# EAGLE design nWatch_BGA (EAGLE 6.4)
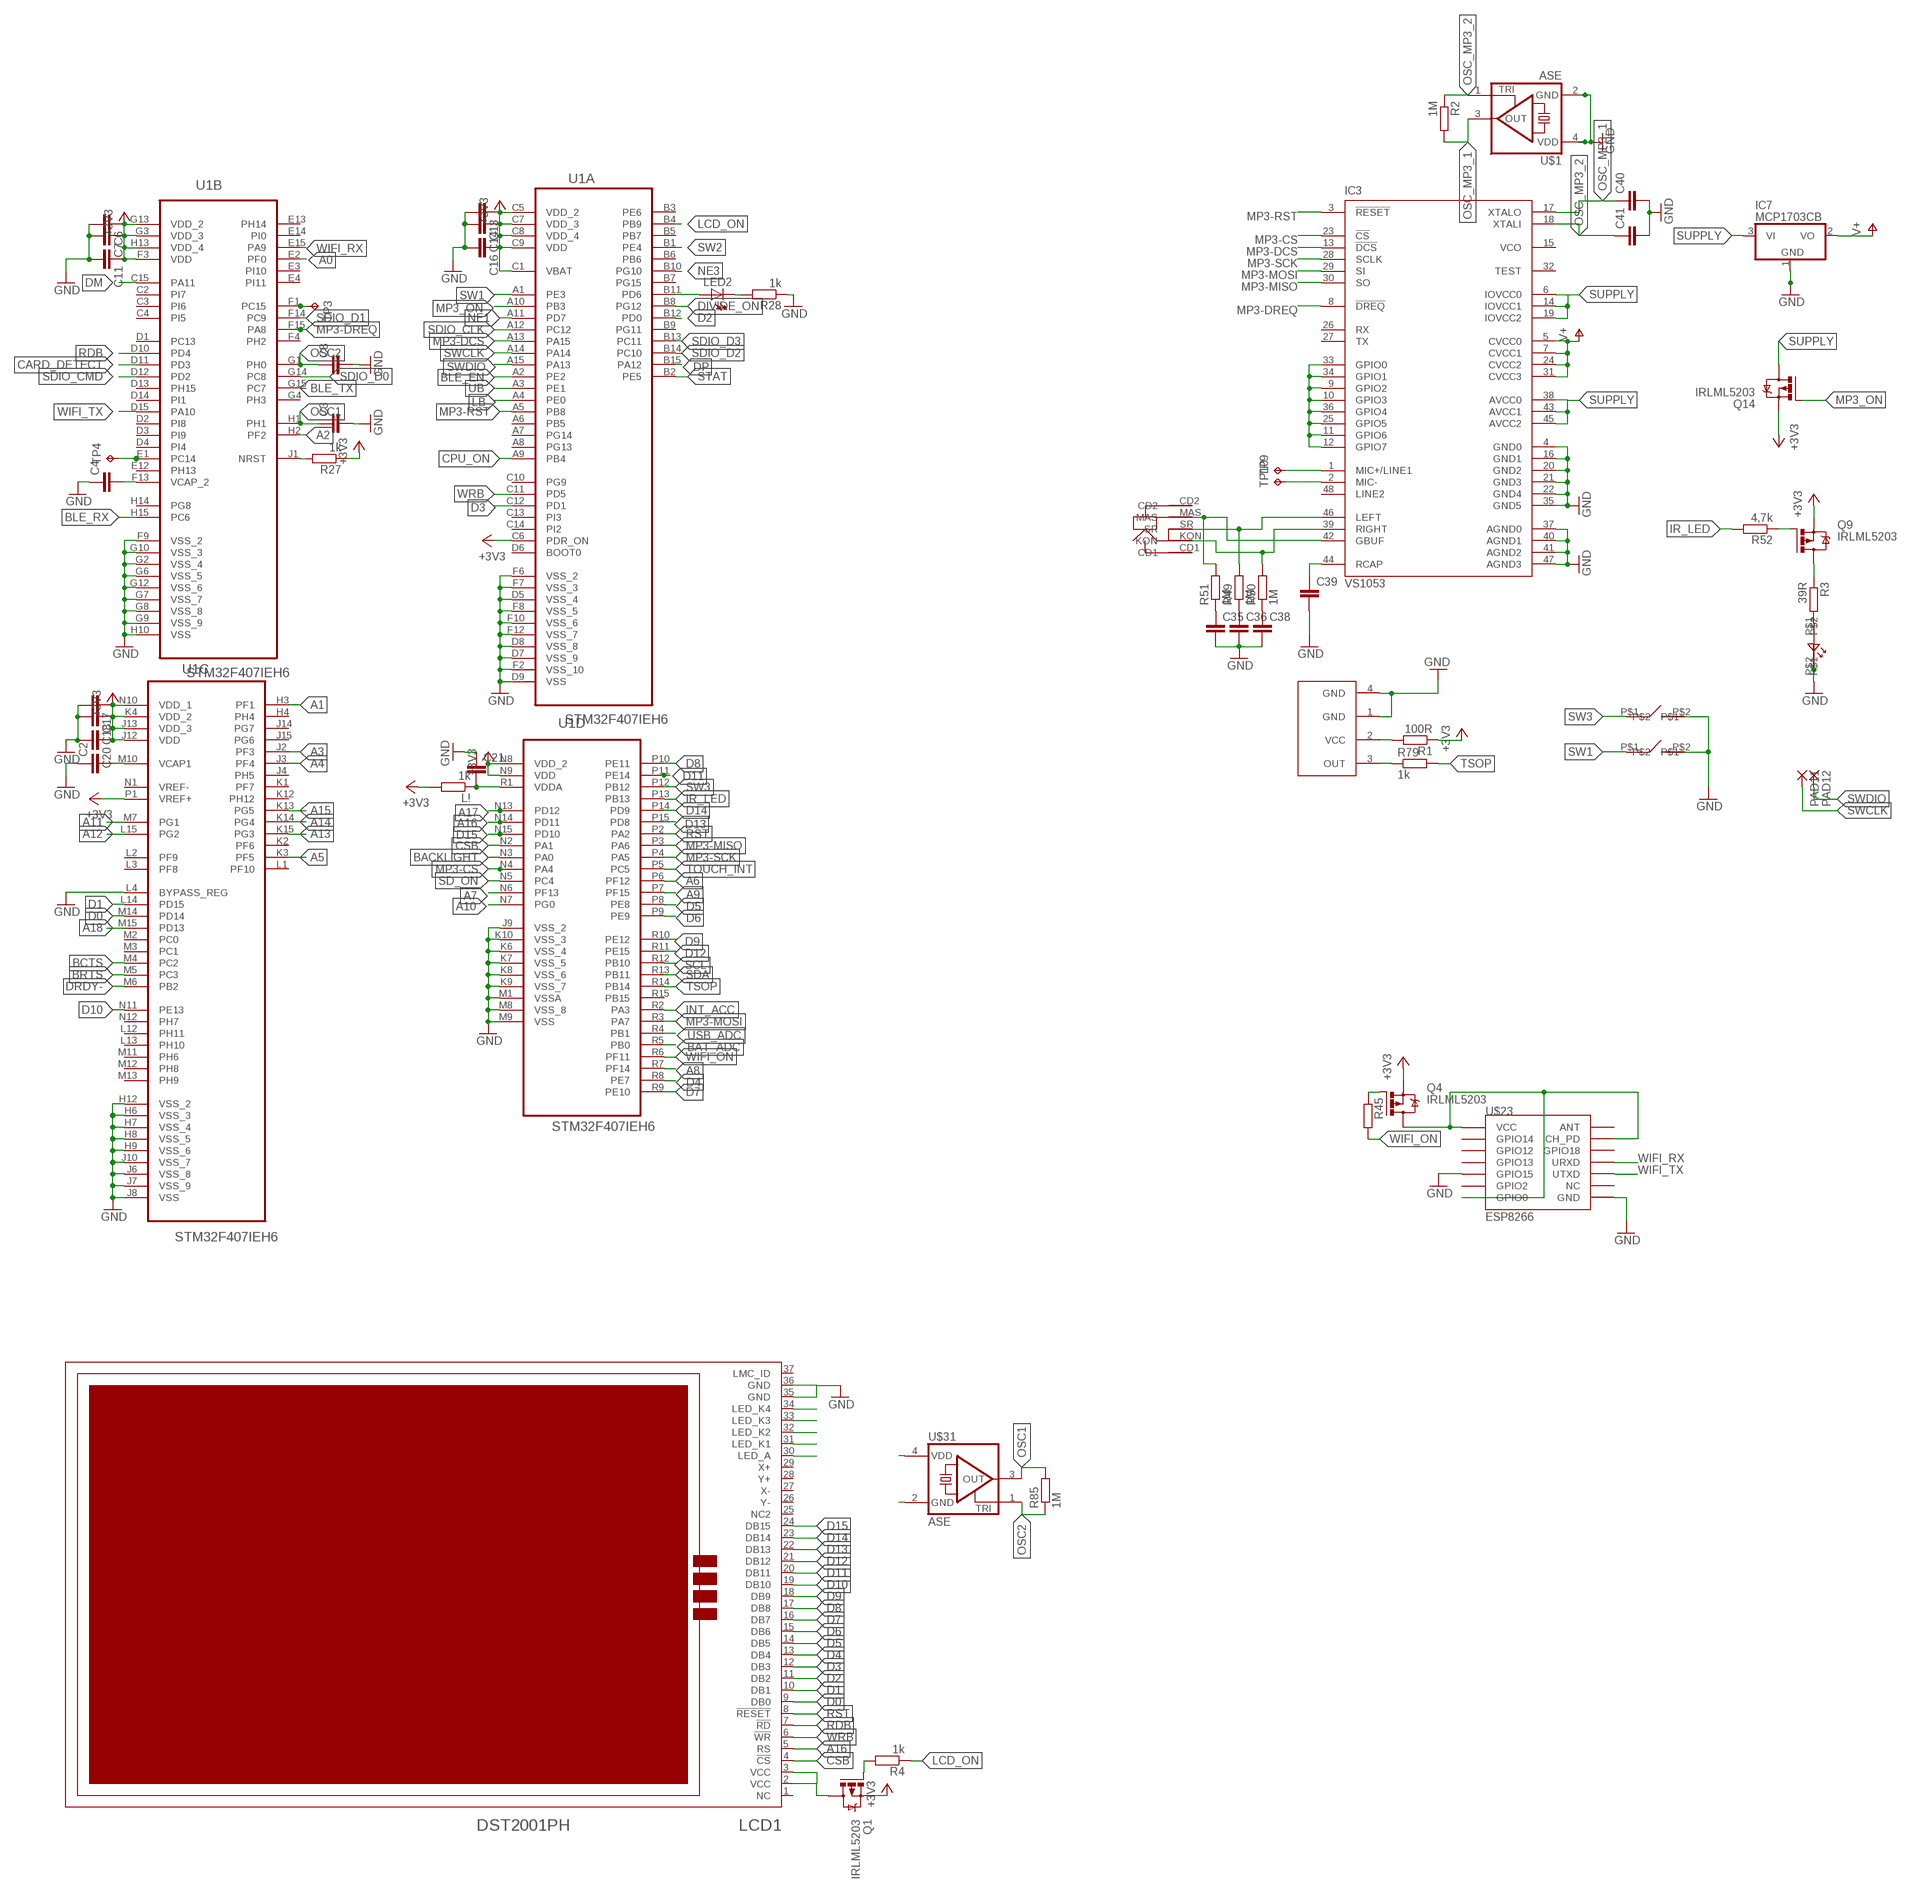
[diagram p0: schematic, sheet 1, part 1 of 2]
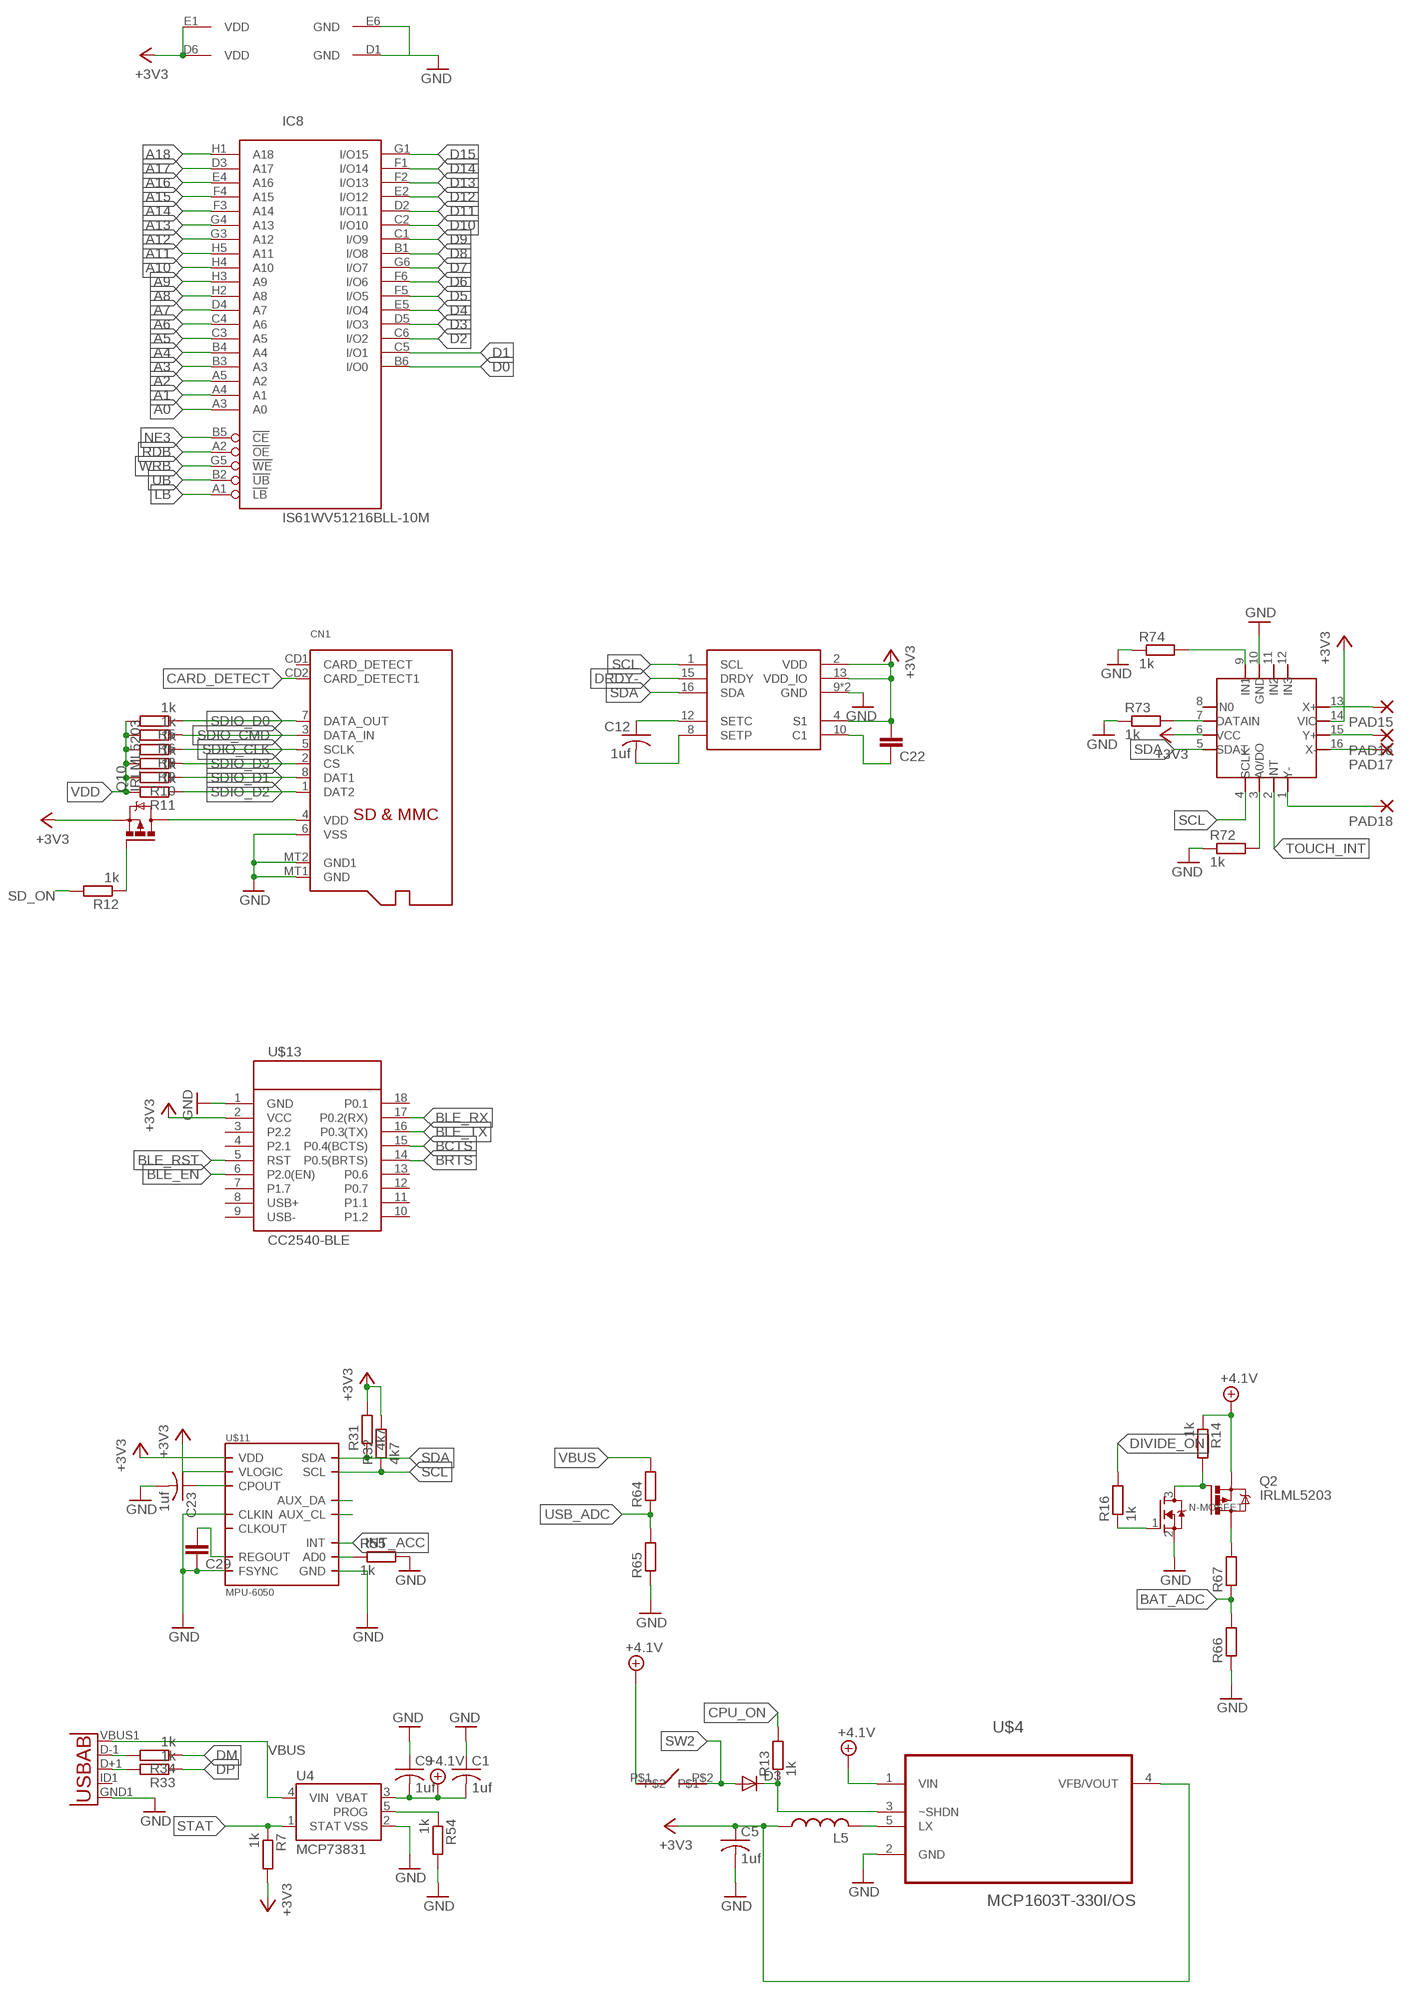
[diagram p1: schematic, sheet 1, part 2 of 2]

## Parts
C1  1uf  C-USC0805K  [C0805K]
C2  C-EUC0402  [C0402]
C3  C-EUC0402  [C0402]
C4  C-EUC0402  [C0402]
C5  1uf  C-USC0805K  [C0805K]
C6  C-EUC0402  [C0402]
C7  C-EUC0402  [C0402]
C8  C-EUC0402  [C0402]
C9  1uf  C-USC0805K  [C0805K]
C11  C-EUC0402  [C0402]
C12  1uf  C-USC0805K  [C0805K]
C13  C-EUC0402  [C0402]
C14  C-EUC0402  [C0402]
C16  C-EUC0402  [C0402]
C17  C-EUC0402  [C0402]
C18  C-EUC0402  [C0402]
C20  C-EUC0402  [C0402]
C21  C-EUC0402  [C0402]
C22  C-EUC0603K  [C0603K]
C23  1uf  C-USC0805K  [C0805K]
C29  C-EUC0603K  [C0603K]
C35  C-EUC0402  [C0402]
C36  C-EUC0402  [C0402]
C38  C-EUC0402  [C0402]
C39  C-EUC0402  [C0402]
C40  C-EUC0402  [C0402]
C41  C-EUC0402  [C0402]
CN1  MICROSD  [MICROSD]
D3  MBR0520LT  [SOD123]
IC3  VS1053  [LQFP-48]
IC7  MCP1703CB  [SOT23]
IC8  IS61WV51216BLL-10M  [TFBGA48_9X11]
L5  L-USL2825P  [L2825P]
L!  1k  R-EU_R0402  [R0402]
LCD1  DST2001PH  [DST2001PH]
LED2  LEDCHIPLED_0603  [CHIPLED_0603]
N-MOSFET  MOSFET-NREFLOW  [SOT23]
PAD11  SMD2  [SMD1,27-2,54]
PAD12  SMD2  [SMD1,27-2,54]
PAD15  SMD2  [SMD1,27-2,54]
PAD16  SMD2  [SMD1,27-2,54]
PAD17  SMD2  [SMD1,27-2,54]
PAD18  SMD2  [SMD1,27-2,54]
Q1  IRLML5203  [MICRO3]
Q2  IRLML5203  [MICRO3]
Q4  IRLML5203  [MICRO3]
Q9  IRLML5203  [MICRO3]
Q10  IRLML5203  [MICRO3]
Q14  IRLML5203  [MICRO3]
R1  100R  R-EU_R0402  [R0402]
R2  1M  R-EU_R0402  [R0402]
R3  39R  R-EU_R0402  [R0402]
R4  1k  R-EU_R0402  [R0402]
R5  1k  R-EU_R0402  [R0402]
R6  1k  R-EU_R0402  [R0402]
R7  1k  R-EU_R0402  [R0402]
R8  1k  R-EU_R0402  [R0402]
R9  1k  R-EU_R0402  [R0402]
R10  1k  R-EU_R0402  [R0402]
R11  1k  R-EU_R0402  [R0402]
R12  1k  R-EU_R0402  [R0402]
R13  1k  R-EU_R0402  [R0402]
R14  1k  R-EU_R0402  [R0402]
R16  1k  R-EU_R0402  [R0402]
R27  1k  R-EU_R0402  [R0402]
R28  1k  R-EU_R0402  [R0402]
R31  4k7  R-EU_R0402  [R0402]
R32  4k7  R-EU_R0402  [R0402]
R33  1k  R-EU_R0402  [R0402]
R34  1k  R-EU_R0402  [R0402]
R45  R-EU_R0603  [R0603]
R49  1M  R-EU_R0402  [R0402]
R50  1M  R-EU_R0402  [R0402]
R51  1M  R-EU_R0402  [R0402]
R52  4,7k  R-EU_R0402  [R0402]
R54  1k  R-EU_R0402  [R0402]
R55  1k  R-EU_R0402  [R0402]
R64  R-EU_R0402  [R0402]
R65  R-EU_R0402  [R0402]
R66  R-EU_R0402  [R0402]
R67  R-EU_R0402  [R0402]
R72  1k  R-EU_R0402  [R0402]
R73  1k  R-EU_R0402  [R0402]
R74  1k  R-EU_R0402  [R0402]
R79  1k  R-EU_R0402  [R0402]
R85  1M  R-EU_R0402  [R0402]
TP3  TPTP08SQ  [TP08SQ]
TP4  TPTP08SQ  [TP08SQ]
TP9  TPTP08SQ  [TP08SQ]
TP10  TPTP08SQ  [TP08SQ]
U1  STM32F407IEH6  [BGA176C65P15X15_1000X1000X60]
U4  MCP73831  [SOT23-5]
U5  USB""  [USB-MICRO-SMD]
U$1  ASE  [ASE]
U$2  TSOP77338TS  [TSOP77338]
U$4  MCP1603T-330I/OS  [SOT95P280X110-5N]
U$5  SWITCHSMD  [SWITCHSMD]
U$11  MPU-6050  [QFN.24.4X4]
U$12  HMC5883L  [LPCC16]
U$13  MOJ_BLEMOJ_BLE  [CC2540-MINI-BLE]
U$15  STMPE811  [QFN-16]
U$16  SWITCHSMD  [SWITCHSMD]
U$23  ESP8266  [ESP-03]
U$26  VISHAY_IRLED  [VISHAY_IRLED]
U$30  SWITCHSMD  [SWITCHSMD]
U$31  ASE  [ASE]
U$32  MOJ_JACK  [MOJ_JACK]

## Nets
+3V3: C5.1 C6.1 C7.1 C11.1 C13.1 C14.1 C16.1 C17.1 C18.1 C20.1 C22.2 IC8.D6(VDD) IC8.E1(VDD) L5.1 L!.2 Q1.2(S) Q4.2(S) Q9.2(S) Q10.2(S) Q14.2(S) R1.1 R7.2 R27.1 R31.2 R32.2 U1.C1(A:VBAT) U1.C5(A:VDD_2) U1.C6(A:PDR_ON) U1.C7(A:VDD_3) U1.C8(A:VDD_4) U1.C9(A:VDD) U1.F3(B:VDD) U1.G3(B:VDD_3) U1.G13(B:VDD_2) U1.H13(B:VDD_4) U1.J12(C:VDD) U1.J13(C:VDD_3) U1.K4(C:VDD_2) U1.N8(D:VDD_2) U1.N9(D:VDD) U1.N10(C:VDD_1) U1.P1(C:VREF+) U$4.4(VFB/VOUT) U$11.8(VLOGIC) U$11.13(VDD) U$12.2(VDD) U$12.4(S1) U$12.13(VDD_IO) U$13.2(VCC) U$15.6(VCC) U$15.14(VIO)
+4.1V: C1.2 C9.2 Q2.2(S) R14.1 U4.3(VBAT) U$4.1(VIN) U$5.P$1
A0: IC8.A3(A0) U1.E2(B:PF0)
A1: IC8.A4(A1) U1.H3(C:PF1)
A2: IC8.A5(A2) U1.H2(B:PF2)
A3: IC8.B3(A3) U1.J2(C:PF3)
A4: IC8.B4(A4) U1.J3(C:PF4)
A5: IC8.C3(A5) U1.K3(C:PF5)
A6: IC8.C4(A6) U1.P6(D:PF12)
A7: IC8.D4(A7) U1.N6(D:PF13)
A8: IC8.H2(A8) U1.R7(D:PF14)
A9: IC8.H3(A9) U1.P7(D:PF15)
A10: IC8.H4(A10) U1.N7(D:PG0)
A11: IC8.H5(A11) U1.M7(C:PG1)
A12: IC8.G3(A12) U1.L15(C:PG2)
A13: IC8.G4(A13) U1.K15(C:PG3)
A14: IC8.F3(A14) U1.K14(C:PG4)
A15: IC8.F4(A15) U1.K13(C:PG5)
A16: IC8.E4(A16) LCD1.5(RS) U1.N14(D:PD11)
A17: IC8.D3(A17) U1.N13(D:PD12)
A18: IC8.H1(A18) U1.M15(C:PD13)
BACKLIGHT: U1.N3(D:PA0)
BAT_ADC: R66.2 R67.1 U1.R5(D:PB0)
BCTS: U1.M4(C:PC2) U$13.15(P0.4(BCTS))
BLE_EN: U1.A2(A:PE2) U$13.6(P2.0(EN))
BLE_RST: U$13.5(RST)
BLE_RX: U1.H15(B:PC6) U$13.17(P0.2(RX))
BLE_TX: U1.G15(B:PC7) U$13.16(P0.3(TX))
BRTS: U1.M5(C:PC3) U$13.14(P0.5(BRTS))
CARD_DETECT: CN1.CD2(CARD_DETECT1) U1.D11(B:PD3)
CPU_ON: R13.2 U1.A9(A:PB4)
CSB: LCD1.4(!CS) U1.N2(D:PA1)
D0: IC8.B6(I/O0) LCD1.9(DB0) U1.M14(C:PD14)
D1: IC8.C5(I/O1) LCD1.10(DB1) U1.L14(C:PD15)
D2: IC8.C6(I/O2) LCD1.11(DB2) U1.B12(A:PD0)
D3: IC8.D5(I/O3) LCD1.12(DB3) U1.C12(A:PD1)
D4: IC8.E5(I/O4) LCD1.13(DB4) U1.R8(D:PE7)
D5: IC8.F5(I/O5) LCD1.14(DB5) U1.P8(D:PE8)
D6: IC8.F6(I/O6) LCD1.15(DB6) U1.P9(D:PE9)
D7: IC8.G6(I/O7) LCD1.16(DB7) U1.R9(D:PE10)
D8: IC8.B1(I/O8) LCD1.17(DB8) U1.P10(D:PE11)
D9: IC8.C1(I/O9) LCD1.18(DB9) U1.R10(D:PE12)
D10: IC8.C2(I/O10) LCD1.19(DB10) U1.N11(C:PE13)
D11: IC8.D2(I/O11) LCD1.20(DB11) U1.P11(D:PE14)
D12: IC8.E2(I/O12) LCD1.21(DB12) U1.R11(D:PE15)
D13: IC8.F2(I/O13) LCD1.22(DB13) U1.P15(D:PD8)
D14: IC8.F1(I/O14) LCD1.23(DB14) U1.P14(D:PD9)
D15: IC8.G1(I/O15) LCD1.24(DB15) U1.N15(D:PD10)
DIVIDE_ON: R16.2 U1.B8(A:PG12)
DM: R34.1 U1.C15(B:PA11)
DP: R33.1 U1.B15(A:PA12)
DRDY-: U1.M6(C:PB2) U$12.15(DRDY)
GND: C1.1 C2.1 C3.2 C4.1 C5.2 C6.2 C7.2 C8.2 C9.1 C11.2 C13.2 C14.2 C16.2 C17.2 C18.2 C20.2 C21.1 C23.2 C29.1 C35.2 C36.2 C38.2 C39.2 C40.2 C41.2 CN1.6(VSS) CN1.MT1(GND) CN1.MT2(GND1) IC3.4(GND0) IC3.16(GND1) IC3.20(GND2) IC3.21(GND3) IC3.22(GND4) IC3.35(GND5) IC3.37(AGND0) IC3.40(AGND1) IC3.41(AGND2) IC3.47(AGND3) IC7.1(GND) IC8.D1(GND) IC8.E6(GND) LCD1.35(GND) LCD1.36(GND) N-MOSFET.2(S) R28.1 R54.2 R55.2 R65.1 R66.1 R72.1 R73.1 R74.1 U1.D5(A:VSS_4) U1.D7(A:VSS_9) U1.D8(A:VSS_8) U1.D9(A:VSS) U1.F2(A:VSS_10) U1.F6(A:VSS_2) U1.F7(A:VSS_3) U1.F8(A:VSS_5) U1.F9(B:VSS_2) U1.F10(A:VSS_6) U1.F12(A:VSS_7) U1.G2(B:VSS_4) U1.G6(B:VSS_5) U1.G7(B:VSS_7) U1.G8(B:VSS_8) U1.G9(B:VSS_9) U1.G10(B:VSS_3) U1.G12(B:VSS_6) U1.H6(C:VSS_3) U1.H7(C:VSS_4) U1.H8(C:VSS_5) U1.H9(C:VSS_6) U1.H10(B:VSS) U1.H12(C:VSS_2) U1.J6(C:VSS_8) U1.J7(C:VSS_9) U1.J8(C:VSS) U1.J9(D:VSS_2) U1.J10(C:VSS_7) U1.K6(D:VSS_4) U1.K7(D:VSS_5) U1.K8(D:VSS_6) U1.K9(D:VSS_7) U1.K10(D:VSS_3) U1.L4(C:BYPASS_REG) U1.M1(D:VSSA) U1.M8(D:VSS_8) U1.M9(D:VSS) U4.2(VSS) U5.GND1(GND) U$1.2(GND) U$1.4(VDD) U$2.1(GND) U$2.4(GND) U$4.2(GND) U$11.1(CLKIN) U$11.11(FSYNC) U$11.18(GND) U$12.9(GND) U$12.11(GND) U$13.1(GND) U$15.10(GND) U$16.P$2 U$23.GND U$23.GPIO15 U$26.P$2 U$30.P$2 U$31.2(GND) U$31.4(VDD)
INT_ACC: U1.R2(D:PA3) U$11.12(INT)
IR_LED: R52.2 U1.P13(D:PB13)
LB: IC8.A1(!LB) U1.A4(A:PE0)
LCD_ON: R4.1 U1.B4(A:PB9)
MP3-CS: IC3.23(!CS) U1.N4(D:PA4)
MP3-DCS: IC3.13(!DCS) U1.A13(A:PA15)
MP3-DREQ: IC3.8(!DREQ) U1.F15(B:PA8)
MP3-MISO: IC3.30(SO) U1.P3(D:PA6)
MP3-MOSI: IC3.29(SI) U1.R3(D:PA7)
MP3-RST: IC3.3(!RESET) U1.A5(A:PB8)
MP3-SCK: IC3.28(SCLK) U1.P4(D:PA5)
MP3_ON: Q14.1(G) U1.A10(A:PB3)
N$1: LCD1.2(VCC) LCD1.3(VCC) Q1.3(D)
N$3: Q1.1(G) R4.2
N$4: R79.1 U$2.3(OUT)
N$5: R3.2 U$26.P$1
N$6: C21.2 L!.1 U1.R1(D:VDDA)
N$7: N-MOSFET.3(D) Q2.1(G) R14.2
N$8: C2.2 U1.M10(C:VCAP1)
N$9: C4.2 U1.F13(B:VCAP_2)
N$10: D3.C R13.1 U$4.3(~SHDN)
N$11: N-MOSFET.1(G) R16.1
N$12: L5.2 U$4.5(LX)
N$13: Q2.3(D) R67.2
N$29: LCD1.30(LED_A)
N$30: TP4.TP U1.E1(B:PC14)
N$31: LCD1.31(LED_K1)
N$32: LCD1.32(LED_K2)
N$33: LCD1.33(LED_K3)
N$34: LCD1.34(LED_K4)
N$39: TP3.TP U1.F1(B:PC15)
N$41: R27.2 U1.J1(B:NRST)
N$43: LED2.A U1.B11(A:PD6)
N$44: LED2.C R28.2
N$48: C23.1 U$11.20(CPOUT)
N$49: U$11.6(AUX_DA)
N$50: U$11.7(AUX_CL)
N$51: R55.1 U$11.9(AD0)
N$52: R54.1 U4.5(PROG)
N$53: R33.2 U5.D+1(D+)
N$54: R34.2 U5.D-1(D-)
N$55: C12.1 U$12.12(SETC)
N$56: C12.2 U$12.8(SETP)
N$60: C22.1 U$12.10(C1)
N$61: C29.2 U$11.10(REGOUT)
N$70: R73.2 U$15.7(DATAIN)
N$71: R74.2 U$15.9(IN1)
N$72: R72.2 U$15.3(A0/DO)
N$73: Q10.1(G) R12.1
N$75: IC3.42(GBUF) R51.2 U$32.MAS
N$76: IC3.46(LEFT) R49.2 U$32.SR
N$77: IC3.39(RIGHT) R50.2 U$32.KON
N$84: C39.1 IC3.44(RCAP)
N$85: IC3.9(GPIO2) IC3.10(GPIO3) IC3.11(GPIO6) IC3.12(GPIO7) IC3.25(GPIO5) IC3.33(GPIO0) IC3.34(GPIO1) IC3.36(GPIO4)
N$86: Q9.1(G) R52.1
N$87: Q9.3(D) R3.1
N$90: Q4.3(D) U$23.CH_PD U$23.GPIO0 U$23.VCC
N$91: Q4.1(G) R45.1
N$94: C35.1 R51.1
N$100: C36.1 R49.1
N$101: C38.1 R50.1
N$102: PAD18.1(P) U$15.1(Y-)
N$103: PAD17.1(P) U$15.16(X-)
N$104: PAD15.1(P) U$15.13(X+)
N$105: PAD16.1(P) U$15.15(Y+)
N$115: R1.2 U$2.2(VCC)
N$118: IC3.2(MIC-) TP10.TP
N$119: IC3.1(MIC+/LINE1) TP9.TP
NE1: U1.A11(A:PD7)
NE3: IC8.B5(!CE) U1.B10(A:PG10)
OSC1: C3.1 R85.2 U1.H1(B:PH1) U$31.3(OUT)
OSC2: C8.1 R85.1 U1.G1(B:PH0) U$31.1(TRI)
OSC_MP3_1: C40.1 IC3.17(XTALO) R2.2 U$1.3(OUT)
OSC_MP3_2: C41.1 IC3.18(XTALI) R2.1 U$1.1(TRI)
RDB: IC8.A2(!OE) LCD1.7(!RD) U1.D10(B:PD4)
RST: LCD1.8(!RESET) U1.P2(D:PA2)
SCL: R32.1 U1.R12(D:PB10) U$11.23(SCL) U$12.1(SCL) U$15.4(SCLK)
SD_ON: R12.2 U1.N5(D:PC4)
SDA: R31.1 U1.R13(D:PB11) U$11.24(SDA) U$12.16(SDA) U$15.5(SDAT)
SDIO_CLK: CN1.5(SCLK) R8.1 U1.A12(A:PC12)
SDIO_CMD: CN1.3(DATA_IN) R6.1 U1.D12(B:PD2)
SDIO_D0: CN1.7(DATA_OUT) R5.1 U1.G14(B:PC8)
SDIO_D1: CN1.8(DAT1) R10.1 U1.F14(B:PC9)
SDIO_D2: CN1.1(DAT2) R11.1 U1.B14(A:PC10)
SDIO_D3: CN1.2(CS) R9.1 U1.B13(A:PC11)
STAT: R7.1 U1.B2(A:PE5) U4.1(STAT)
SUPPLY: IC3.6(IOVCC0) IC3.14(IOVCC1) IC3.19(IOVCC2) IC3.38(AVCC0) IC3.43(AVCC1) IC3.45(AVCC2) IC7.3(VI) Q14.3(D)
SW1: U1.A1(A:PE3) U$16.P$1
SW2: D3.A U1.B1(A:PE4) U$5.P$2
SW3: U1.P12(D:PB12) U$30.P$1
SWCLK: PAD11.1(P) U1.A14(A:PA14)
SWDIO: PAD12.1(P) U1.A15(A:PA13)
TOUCH_INT: U1.P5(D:PC5) U$15.2(INT)
TSOP: R79.2 U1.R14(D:PB14)
UB: IC8.B2(!UB) U1.A3(A:PE1)
USB_ADC: R64.1 R65.2 U1.R4(D:PB1)
V+: IC3.5(CVCC0) IC3.7(CVCC1) IC3.24(CVCC2) IC3.31(CVCC3) IC7.2(VO)
VBUS: R64.2 U4.4(VIN) U5.VBUS1(VBUS)
VDD: CN1.4(VDD) Q10.3(D) R5.2 R6.2 R8.2 R9.2 R10.2 R11.2
WIFI_ON: R45.2 U1.R6(D:PF11)
WIFI_RX: U1.E15(B:PA9) U$23.URXD
WIFI_TX: U1.D15(B:PA10) U$23.UTXD
WRB: IC8.G5(!WE) LCD1.6(!WR) U1.C11(A:PD5)
Unconnected: CN1.CD1(CARD_DETECT) IC3.15(VCO) IC3.26(RX) IC3.27(TX) IC3.32(TEST) IC3.48(LINE2) LCD1.1(NC) LCD1.25(NC2) LCD1.26(Y-) LCD1.27(X-) LCD1.28(Y+) LCD1.29(X+) LCD1.37(LMC_ID) U1.A6(A:PB5) U1.A7(A:PG14) U1.A8(A:PG13) U1.B3(A:PE6) U1.B5(A:PB7) U1.B6(A:PB6) U1.B7(A:PG15) U1.B9(A:PG11) U1.C2(B:PI7) U1.C3(B:PI6) U1.C4(B:PI5) U1.C10(A:PG9) U1.C13(A:PI3) U1.C14(A:PI2) U1.D1(B:PC13) U1.D2(B:PI8) U1.D3(B:PI9) U1.D4(B:PI4) U1.D6(A:BOOT0) U1.D13(B:PH15) U1.D14(B:PI1) U1.E3(B:PI10) U1.E4(B:PI11) U1.E12(B:PH13) U1.E13(B:PH14) U1.E14(B:PI0) U1.F4(B:PH2) U1.G4(B:PH3) U1.H4(C:PH4) U1.H14(B:PG8) U1.J4(C:PH5) U1.J14(C:PG7) U1.J15(C:PG6) U1.K1(C:PF7) U1.K2(C:PF6) U1.K12(C:PH12) U1.L1(C:PF10) U1.L2(C:PF9) U1.L3(C:PF8) U1.L12(C:PH11) U1.L13(C:PH10) U1.M2(C:PC0) U1.M3(C:PC1) U1.M11(C:PH6) U1.M12(C:PH8) U1.M13(C:PH9) U1.N12(C:PH7) U1.R15(D:PB15) U5.ID1(USBID) U$11.22(CLKOUT) U$13.4(P2.1) U$13.7(P1.7) U$13.8(USB+) U$13.9(USB-) U$13.10(P1.2) U$13.11(P1.1) U$13.12(P0.7) U$13.13(P0.6) U$13.18(P0.1) U$15.8(IN0) U$15.11(IN2) U$15.12(IN3) U$23.ANT U$23.GPIO2 U$23.GPIO12 U$23.GPIO13 U$23.GPIO14 U$23.GPIO18 U$23.NC U$32.CD1 U$32.CD2

## Power pins joined to a net without a drawn wire
P2.2: U$13.3(P2.2)
VREF-: U1.N1(C:VREF-)

## Library data of the parts
C1 C5 C9 C12 C23 = rcl:C-US: CAPACITOR, American symbol
C2-C4 C6-C8 C11 C13 C14 C16-C18 C20-C22 C29 C35 C36 C38-C41 = rcl:C-EU: CAPACITOR, European symbol
CN1 = microbuilder:MICROSD: MicroSD/Transflash Card Holder with SPI pinout 3M: 2908-05WB-M6 4UConnector: 19656 Footprint courtesy: Adafruit Industries
D3 = _mod_diode:MBR0520LT: SCHOTTKY BARRIER RECTIFIER Source: http://onsemi.com .. MBR0520LT1-D.pdf
IC3 = welectronic:VS1053
IC7 = linear:MCP1703: 250 mA, 16V, Low Quiescent Current LDO Regulator Source: http://ww1.microchip.com/downloads/en/DeviceDoc/22049b.pdf
IC8 = memory-issi-asynsram:IS61WV51216BLL-*: 512k x 16 high- speed CMOS static RAM 10ns access time 3.6V power supply
L5 = rcl:L-US: INDUCTOR, American symbol
L! R1-R14 R16 R27 R28 R31-R34 R45 R49-R52 R54 R55 R64-R67 R72-R74 R79 R85 = rcl:R-EU_: RESISTOR, European symbol
LCD1 = ili9320_klonyyy:DST2001PH
LED2 = led:LED: LED OSRAM: - CHIPLED LG R971, LG N971, LY N971, LG Q971, LY Q971, LO R971, LY R971 LH N974, LH R974 LS Q976, LO Q976, LY Q976 LO Q996 - Hyper CHIPLED LW Q18S LB Q993, LB Q99A, LB R99A - SideLED LS A670, LO A670, LY A670, LG A670, LP A670 LB A673, LV A673, LT A673, LW A673 LH A674 LY A675 LS A676, LA A676, LO A676, LY A676, LW A676 LS A679, LY A679, LG A679 - Hyper Micro SIDELED® LS Y876, LA Y876, LO Y876, LY Y876 LT Y87S - SmartLED LW L88C, LW L88S LB L89C, LB L89S, LG L890 LS L89K, LO L89K, LY L89K LS L896, LA L896, LO L896, LY L896 - TOPLED LS T670, LO T670, LY T670, LG T670, LP T670 LSG T670, LSP T670, LSY T670, LOP T670, LYG T670 LG T671, LOG T671, LSG T671 LB T673, LV T673, LT T673, LW T673 LH T674 LS T676, LA T676, LO T676, LY T676, LB T676, LH T676, LSB T676, LW T676 LB T67C, LV T67C, LT T67C, LS T67K, LO T67K, LY T67K, LW E67C LS E67B, LA E67B, LO E67B, LY E67B, LB E67C, LV E67C, LT E67C LW T67C LS T679, LY T679, LG T679 LS T770, LO T770, LY T770, LG T770, LP T770 LB T773, LV T773, LT T773, LW T773 LH T774 LS E675, LA E675, LY E675, LS T675 LS T776, LA T776, LO T776, LY T776, LB T776 LHGB T686 LT T68C, LB T68C - Hyper Mini TOPLED® LB M676 - Mini TOPLED Santana® LG M470 LS M47K, LO M47K, LY M47K Source: http://www.osram.convergy.de LUXEON: - LUMILED® LXK2-PW12-R00, LXK2-PW12-S00, LXK2-PW14-U00, LXK2-PW14-V00 LXK2-PM12-R00, LXK2-PM12-S00, LXK2-PM14-U00 LXK2-PE12-Q00, LXK2-PE12-R00, LXK2-PE12-S00, LXK2-PE14-T00, LXK2-PE14-U00 LXK2-PB12-K00, LXK2-PB12-L00, LXK2-PB12-M00, LXK2-PB14-N00, LXK2-PB14-P00, LXK2-PB14-Q00 LXK2-PR12-L00, LXK2-PR12-M00, LXK2-PR14-Q00, LXK2-PR14-R00 LXK2-PD12-Q00, LXK2-PD12-R00, LXK2-PD12-S00 LXK2-PH12-R00, LXK2-PH12-S00 LXK2-PL12-P00, LXK2-PL12-Q00, LXK2-PL12-R00 Source: www.luxeon.com KINGBRIGHT: KA-3528ASYC Source: www.kingbright.com
N-MOSFET = adafruit:MOSFET-N: N-Channel Mosfet 2N7002E - 60V 260mA SOT23 [Digikey: 2N7002ET1GOSTR-ND] - REEL BSH103 - 30V 850mA SOT23 [Digikey: 568-5013-1-ND]
PAD11 PAD12 PAD15-PAD18 = wirepad:SMD2: SMD PAD
Q1 Q2 Q4 Q9 Q10 Q14 = transistor-power:IRLML5203: HEXFET P-Channel Power MOSFET
TP3 TP4 TP9 TP10 = testpad:TP: Test pad
U1 = stm32f407_bga:STM32F407IEH6: ARM Cortex-M4 32b MCU+FPU,176 UFBGA; MPN: STM32F407IEH6; OC_FARNELL: 2215227; OC_NEWARK: 46W2201; PACKAGE: UFBGA-176; SUPPLIER: STMICROELECTRONICS
U4 = SparkFun:MCP73831: Microchip's MCP73831 Miniature single cell, fully integrated Li-Ion, Li-polymer charge management controller http://ww1.microchip.com/downloads/en/DeviceDoc/21984a.pdf
U5 = microusb:USB: This is a USB AB connector that is compatible with USB OTG. i.e. this connector can serve as a host or device
U$1 U$31 = crystal-2:ASE: 3.3Vdc CMOS SMD CRYSTAL CLOCK OSCILLATOR SOurce: www.abracon.com; OC_FARNELL: unknown; OC_NEWARK: unknown
U$2 = TSOP_SMD:TSOP77338: Liten IR receiver ytmonterad ca 12kr pa Farnell. http://www.vishay.com/docs/83346/tsop773.pdf
U$4 = MCP1603T-330:MCP1603T-330I/OS: 2.0 MHz, 500 mA Synchronous Buck Regulator; MPN: MCP1603T-330I/OS; OC_FARNELL: 1439373; OC_NEWARK: 22K1332; PACKAGE: SOT23-5; SUPPLIER: Microchip
U$5 U$16 U$30 = SWITCHSMD:SWITCHSMD
U$11 = MPU-6050:MPU-6050
U$12 = hmc5883l:HMC5883L
U$13 = cc2540:MOJ_BLE
U$15 = stmpe811:STMPE811
U$23 = esp8266modules:ESP8266: ESP8266 Wifi module 03 & 04
U$26 = vishay_irled:VISHAY_IRLED
U$32 = moj_jack3.5_MIRROR:MOJ_JACK

## Board
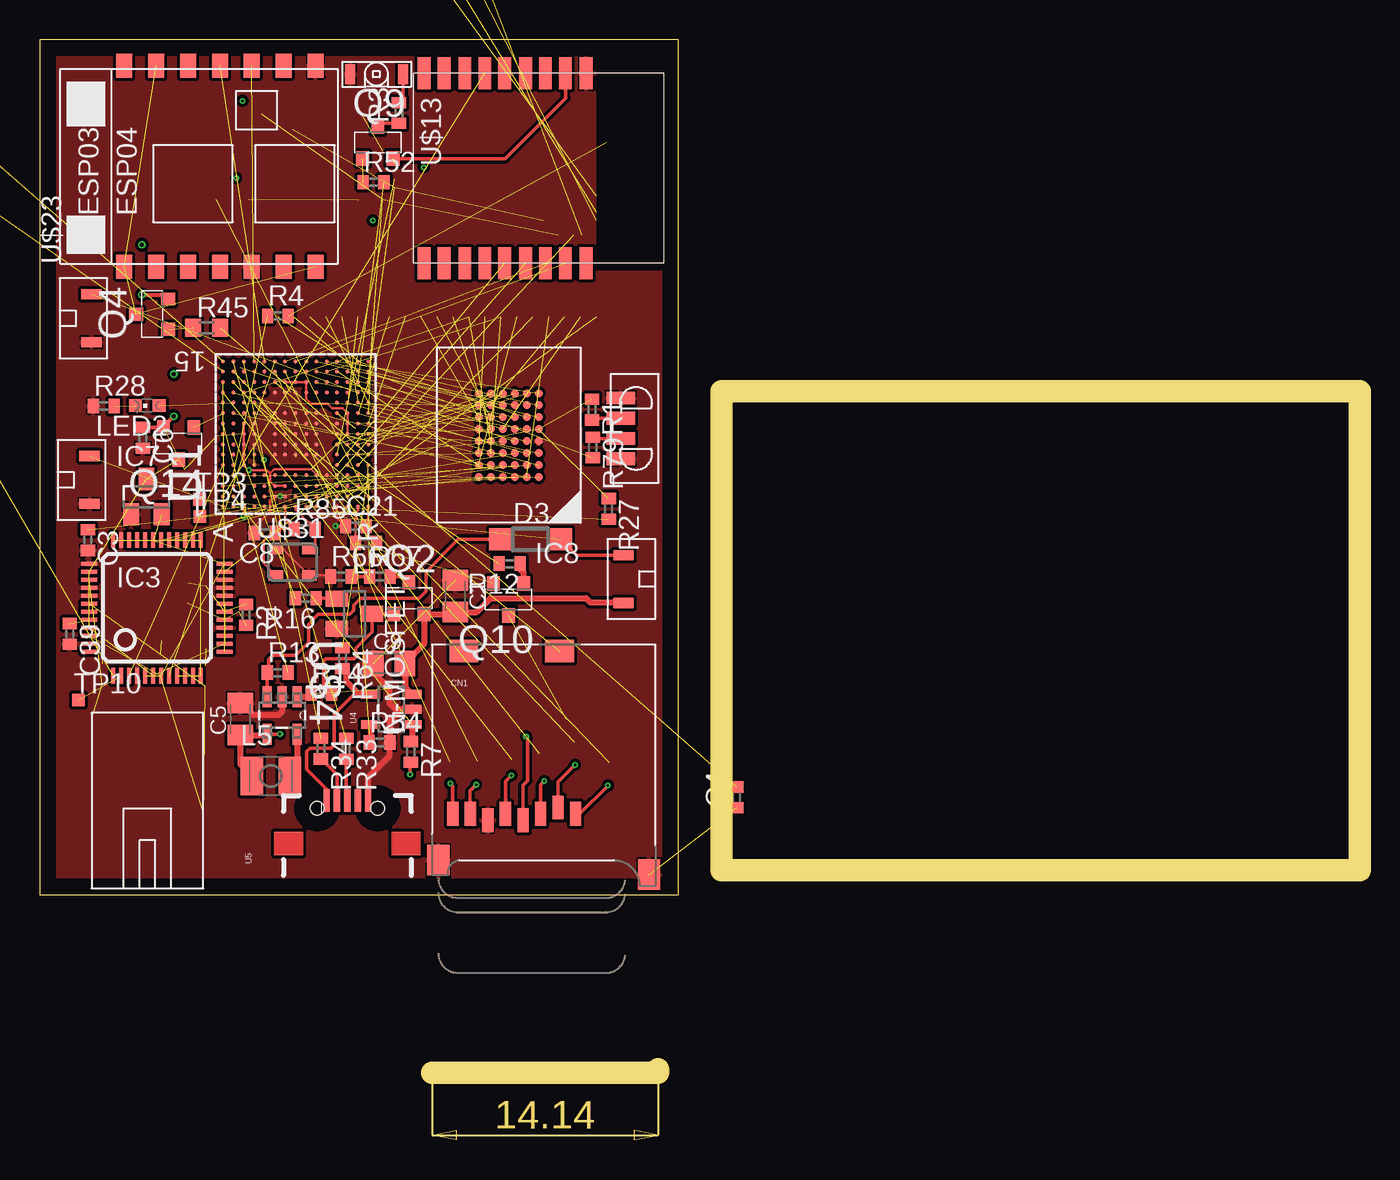
[diagram p2: board, top side]
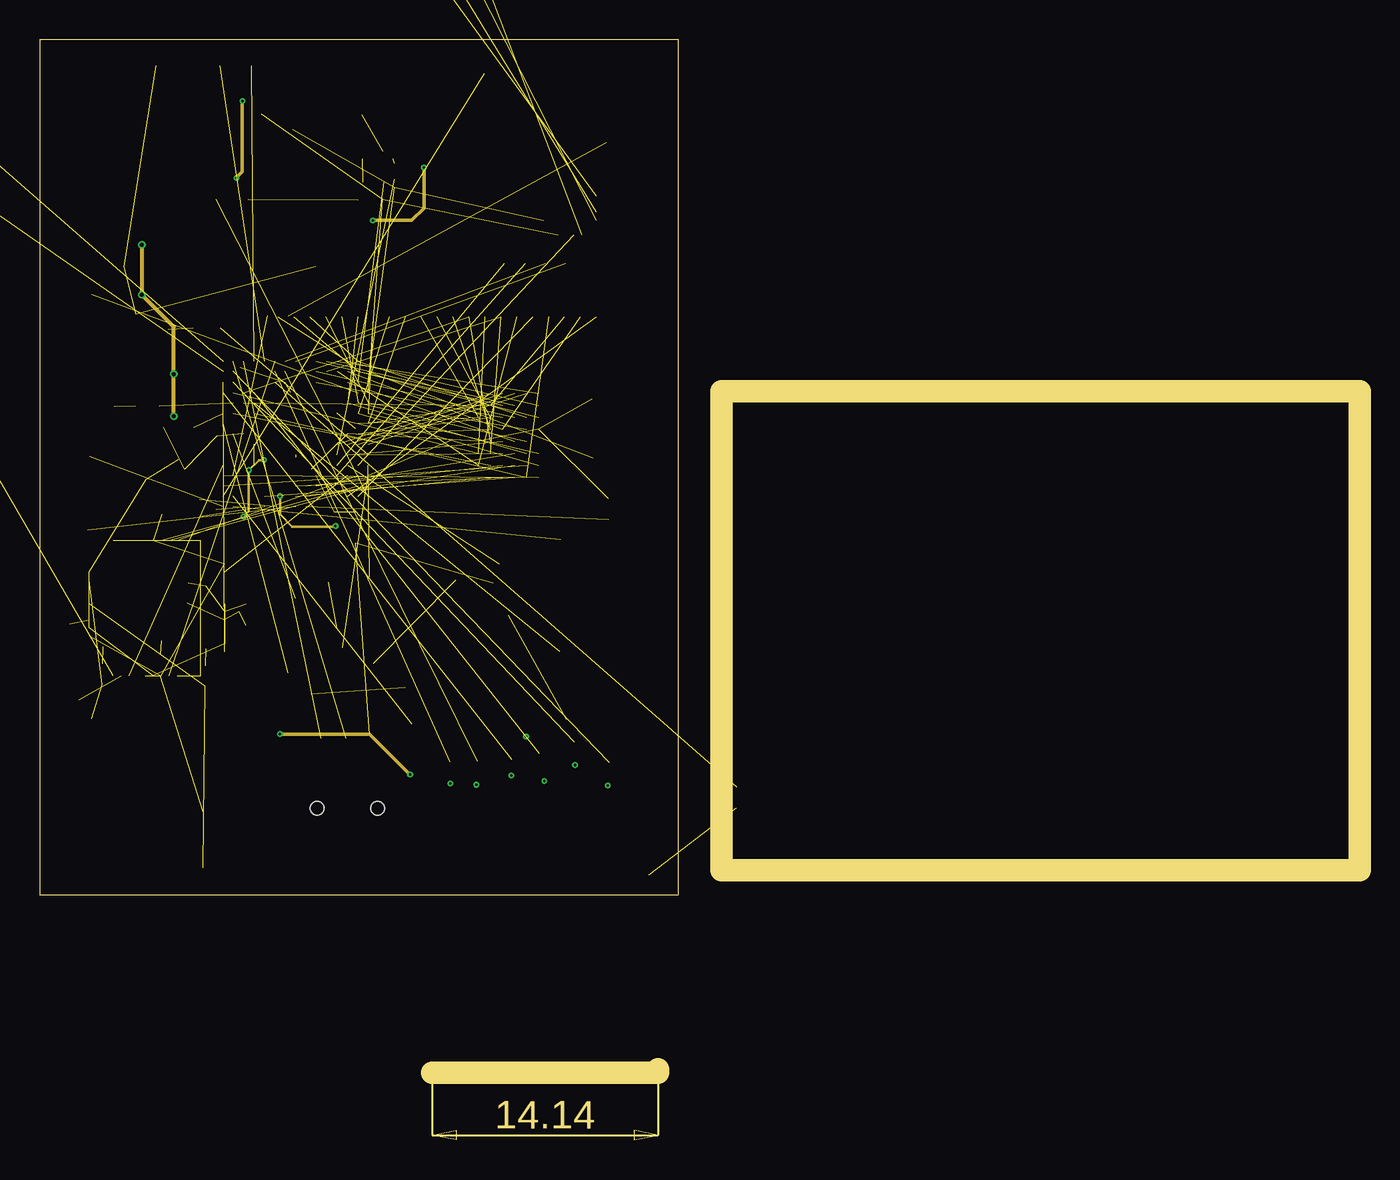
[diagram p3: board, inner layer Route2]
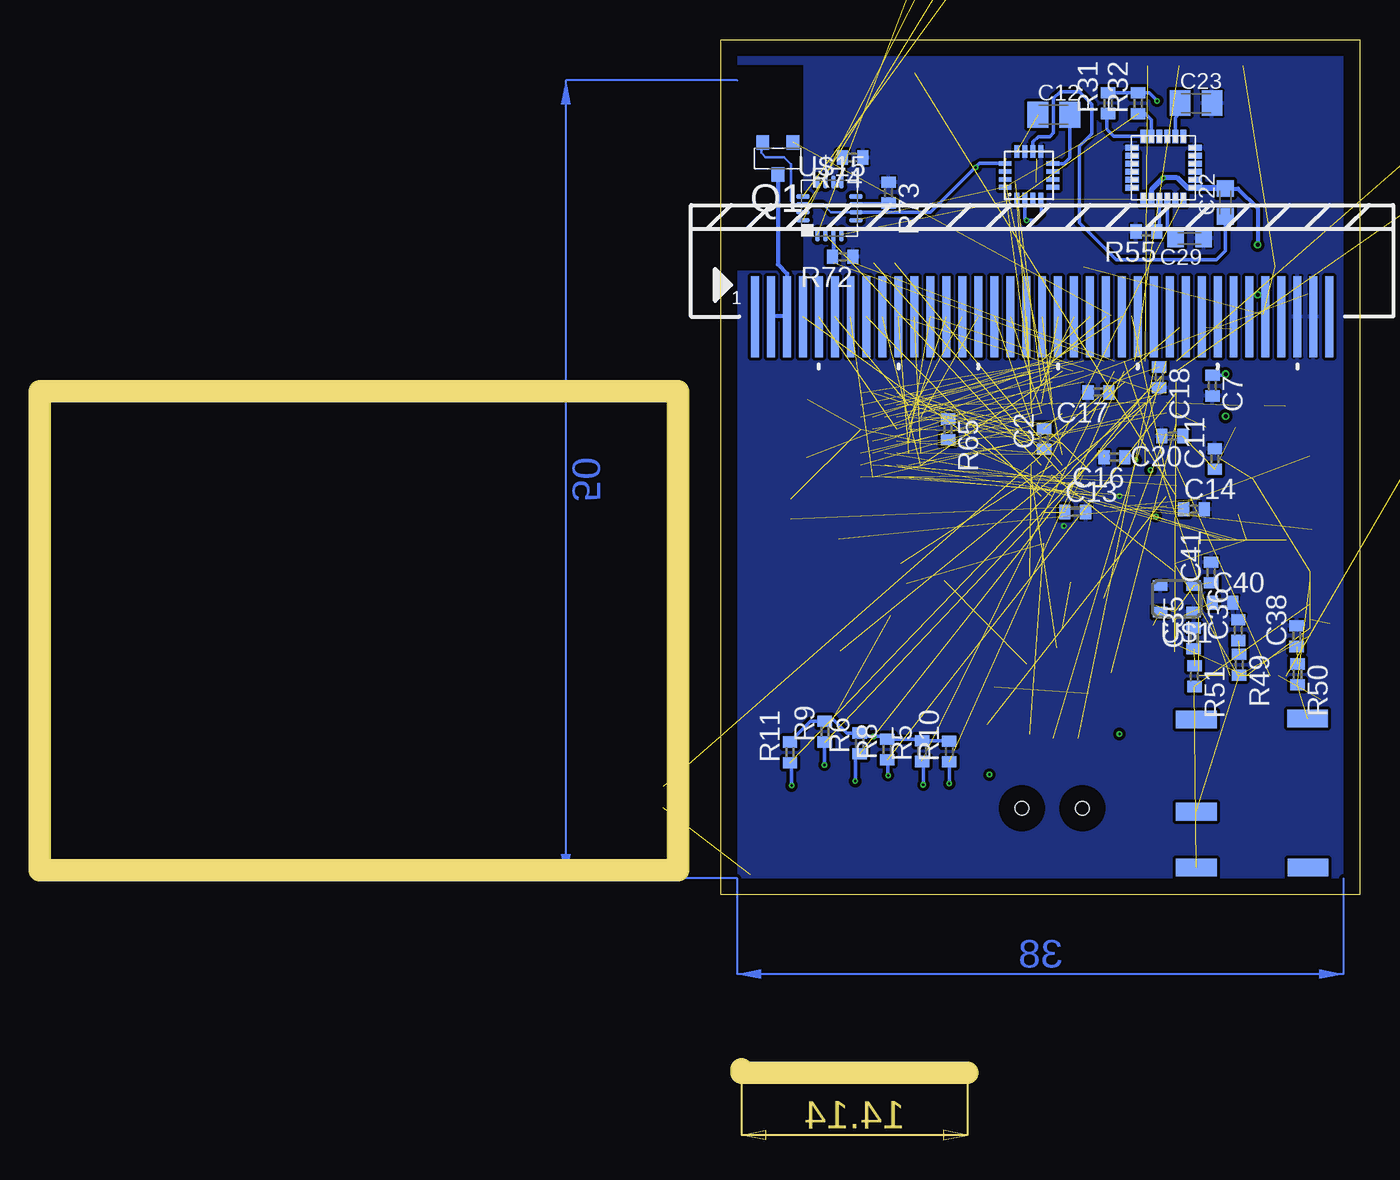
[diagram p4: board, bottom side, seen from below]

Size 82.73 x 64.73 mm. Coordinates in mm from the lower left corner, seen from the top.
Outline: 24.6,0 38.74,0 38.74,0.24
Outline: 0,11.18 40.03,11.18 40.03,64.73 0,64.73 0,11.18
Outline: 42.73,12.7 42.73,42.7 82.73,42.7 82.73,12.7 42.73,12.7
Copper layers (1*2*4*16): Top 0.035mm / dielectric 0.4mm / Route2 0.035mm / dielectric 0.4mm / Route4 0.035mm / dielectric 0.4mm / Bottom 0.035mm
Design rules "default *": minimum track width 10mil, minimum drill 24mil, track to track 8mil, track to pad 8mil, pad to pad 8mil, via to via 8mil, smd to smd 8mil, copper to edge 40mil, drill to drill 8mil, minimum pad ring 8mil, minimum via ring 4mil, stop-mask expansion 4mil, vias tented up to drill 0mil, thermal gap 5mil

### Footprints (pad centres in the part's own frame; a part is rotated, then mirrored left to right if it is on the bottom)
C0805K = smd 1.3 x 1.6: 1 -1,0; 2 1,0
C0402 = smd 0.7 x 0.9: 1 -0.65,0; 2 0.65,0
C0603K = smd 1.05 x 1.08: 1 -0.875,0; 2 0.875,0
MICROSD = smd 0.7 x 1.5: 1 9,-10.64; 2 7.9,-10.24; 3 6.8,-10.64; 4 5.7,-11.04; 5 4.6,-10.64; 6 3.5,-11.04; 7 2.4,-10.64; 8 1.3,-10.64 | smd 1.8 x 1.4: CD1 2,-0.44; CD2 8,-0.44 | smd 1.4 x 1.9: MT1 0.4,-13.54; MT2 13.6,-14.44
SOD123 = smd 1.4 x 1.4: A 1.9,0; C -1.9,0
LQFP-48 = smd 0.25 x 1: 1 -2.75,-4.25; 2 -2.25,-4.25; 3 -1.75,-4.25; 4 -1.25,-4.25; 5 -0.75,-4.25; 6 -0.25,-4.25; 7 0.25,-4.25; 8 0.75,-4.25; 9 1.25,-4.25; 10 1.75,-4.25; 11 2.25,-4.25; 12 2.75,-4.25; 25 2.75,4.25; 26 2.25,4.25; 27 1.75,4.25; 28 1.25,4.25; 29 0.75,4.25; 30 0.25,4.25; 31 -0.25,4.25; 32 -0.75,4.25; 33 -1.25,4.25; 34 -1.75,4.25; 35 -2.25,4.25; 36 -2.75,4.25 | smd 1 x 0.25: 13 4.25,-2.75; 14 4.25,-2.25; 15 4.25,-1.75; 16 4.25,-1.25; 17 4.25,-0.75; 18 4.25,-0.25; 19 4.25,0.25; 20 4.25,0.75; 21 4.25,1.25; 22 4.25,1.75; 23 4.25,2.25; 24 4.25,2.75; 37 -4.25,2.75; 38 -4.25,2.25; 39 -4.25,1.75; 40 -4.25,1.25; 41 -4.25,0.75; 42 -4.25,0.25; 43 -4.25,-0.25; 44 -4.25,-0.75; 45 -4.25,-1.25; 46 -4.25,-1.75; 47 -4.25,-2.25; 48 -4.25,-2.75
SOT23 = smd 1 x 1.4: 1 -0.95,-1.1; 2 0.95,-1.1; 3 0,1.1
TFBGA48_9X11 = smd 0.5 x 0.5: A1 -1.875,2.625; A2 -1.125,2.625; A3 -0.375,2.625; A4 0.375,2.625; A5 1.125,2.625; A6 1.875,2.625; B1 -1.875,1.875; B2 -1.125,1.875; B3 -0.375,1.875; B4 0.375,1.875; B5 1.125,1.875; B6 1.875,1.875; C1 -1.875,1.125; C2 -1.125,1.125; C3 -0.375,1.125; C4 0.375,1.125; C5 1.125,1.125; C6 1.875,1.125; D1 -1.875,0.375; D2 -1.125,0.375; D3 -0.375,0.375; D4 0.375,0.375; D5 1.125,0.375; D6 1.875,0.375; E1 -1.875,-0.375; E2 -1.125,-0.375; E3 -0.375,-0.375; E4 0.375,-0.375; E5 1.125,-0.375; E6 1.875,-0.375; F1 -1.875,-1.125; F2 -1.125,-1.125; F3 -0.375,-1.125; F4 0.375,-1.125; F5 1.125,-1.125; F6 1.875,-1.125; G1 -1.875,-1.875; G2 -1.125,-1.875; G3 -0.375,-1.875; G4 0.375,-1.875; G5 1.125,-1.875; G6 1.875,-1.875; H1 -1.875,-2.625; H2 -1.125,-2.625; H3 -0.375,-2.625; H4 0.375,-2.625; H5 1.125,-2.625; H6 1.875,-2.625
L2825P = smd 1.4 x 2.4: 1 -1.2,0; 2 1.2,0
R0402 = smd 0.7 x 0.9: 1 -0.65,0; 2 0.65,0
DST2001PH = smd 5.08 x 0.5: 1 0,18; 2 0,17; 3 0,16; 4 0,15; 5 0,14; 6 0,13; 7 0,12; 8 0,11; 9 0,10; 10 0,9; 11 0,8; 12 0,7; 13 0,6; 14 0,5; 15 0,4; 16 0,3; 17 0,2; 18 0,1; 19 0,0; 20 0,-1; 21 0,-2; 22 0,-3; 23 0,-4; 24 0,-5; 25 0,-6; 26 0,-7; 27 0,-8; 28 0,-9; 29 0,-10; 30 0,-11; 31 0,-12; 32 0,-13; 33 0,-14; 34 0,-15; 35 0,-16; 36 0,-17; 37 0,-18
CHIPLED_0603 = smd 0.8 x 0.8: A 0,-0.75; C 0,0.75
SMD1,27-2,54 = smd 1.27 x 2.54: 1 0,0
MICRO3 = smd 0.8 x 0.9: 1 -0.95,-1; 2 0.95,-1; 3 0,1
R0603 = smd 1 x 1.1: 1 -0.85,0; 2 0.85,0
TP08SQ = smd 0.8 x 0.8: TP 0,0
BGA176C65P15X15_1000X1000X60 = smd 0.254 x 0.254: A1 -4.547,4.547; A2 -3.912,4.547; A3 -3.251,4.547; A4 -2.591,4.547; A5 -1.956,4.547; A6 -1.295,4.547; A7 -0.66,4.547; A8 0,4.547; A9 0.66,4.547; A10 1.295,4.547; A11 1.956,4.547; A12 2.591,4.547; A13 3.251,4.547; A14 3.912,4.547; A15 4.547,4.547; B1 -4.547,3.912; B2 -3.912,3.912; B3 -3.251,3.912; B4 -2.591,3.912; B5 -1.956,3.912; B6 -1.295,3.912; B7 -0.66,3.912; B8 0,3.912; B9 0.66,3.912; B10 1.295,3.912; B11 1.956,3.912; B12 2.591,3.912; B13 3.251,3.912; B14 3.912,3.912; B15 4.547,3.912; C1 -4.547,3.251; C2 -3.912,3.251; C3 -3.251,3.251; C4 -2.591,3.251; C5 -1.956,3.251; C6 -1.295,3.251; C7 -0.66,3.251; C8 0,3.251; C9 0.66,3.251; C10 1.295,3.251; C11 1.956,3.251; C12 2.591,3.251; C13 3.251,3.251; C14 3.912,3.251; C15 4.547,3.251; D1 -4.547,2.591; D2 -3.912,2.591; D3 -3.251,2.591; D4 -2.591,2.591; D5 -1.956,2.591; D6 -1.295,2.591; D7 -0.66,2.591; D8 0,2.591; D9 0.66,2.591; D10 1.295,2.591; D11 1.956,2.591; D12 2.591,2.591; D13 3.251,2.591; D14 3.912,2.591; D15 4.547,2.591; E1 -4.547,1.956; E2 -3.912,1.956; E3 -3.251,1.956; E4 -2.591,1.956; E12 2.591,1.956; E13 3.251,1.956; E14 3.912,1.956; E15 4.547,1.956; F1 -4.547,1.295; F2 -3.912,1.295; F3 -3.251,1.295; F4 -2.591,1.295; F6 -1.295,1.295; F7 -0.66,1.295; F8 0,1.295; F9 0.66,1.295; F10 1.295,1.295; F12 2.591,1.295; F13 3.251,1.295; F14 3.912,1.295; F15 4.547,1.295; G1 -4.547,0.66; G2 -3.912,0.66; G3 -3.251,0.66; G4 -2.591,0.66; G6 -1.295,0.66; G7 -0.66,0.66; G8 0,0.66; G9 0.66,0.66; G10 1.295,0.66; G12 2.591,0.66; G13 3.251,0.66; G14 3.912,0.66; G15 4.547,0.66; H1 -4.547,0; H2 -3.912,0; H3 -3.251,0; H4 -2.591,0; H6 -1.295,0; H7 -0.66,0; H8 0,0; H9 0.66,0; H10 1.295,0; H12 2.591,0; H13 3.251,0; H14 3.912,0; H15 4.547,0; J1 -4.547,-0.66; J2 -3.912,-0.66; J3 -3.251,-0.66; J4 -2.591,-0.66; J6 -1.295,-0.66; J7 -0.66,-0.66; J8 0,-0.66; J9 0.66,-0.66; J10 1.295,-0.66; J12 2.591,-0.66; J13 3.251,-0.66; J14 3.912,-0.66; J15 4.547,-0.66; K1 -4.547,-1.295; K2 -3.912,-1.295; K3 -3.251,-1.295; K4 -2.591,-1.295; K6 -1.295,-1.295; K7 -0.66,-1.295; K8 0,-1.295; K9 0.66,-1.295; K10 1.295,-1.295; K12 2.591,-1.295; K13 3.251,-1.295; K14 3.912,-1.295; K15 4.547,-1.295; L1 -4.547,-1.956; L2 -3.912,-1.956; L3 -3.251,-1.956; L4 -2.591,-1.956; L12 2.591,-1.956; L13 3.251,-1.956; L14 3.912,-1.956; L15 4.547,-1.956; M1 -4.547,-2.591; M2 -3.912,-2.591; M3 -3.251,-2.591; M4 -2.591,-2.591; M5 -1.956,-2.591; M6 -1.295,-2.591; M7 -0.66,-2.591; M8 0,-2.591; M9 0.66,-2.591; M10 1.295,-2.591; M11 1.956,-2.591; M12 2.591,-2.591; M13 3.251,-2.591; M14 3.912,-2.591; M15 4.547,-2.591; N1 -4.547,-3.251; N2 -3.912,-3.251; N3 -3.251,-3.251; N4 -2.591,-3.251; N5 -1.956,-3.251; N6 -1.295,-3.251; N7 -0.66,-3.251; N8 0,-3.251; N9 0.66,-3.251; N10 1.295,-3.251; N11 1.956,-3.251; N12 2.591,-3.251; N13 3.251,-3.251; N14 3.912,-3.251; N15 4.547,-3.251; P1 -4.547,-3.912; P2 -3.912,-3.912; P3 -3.251,-3.912; P4 -2.591,-3.912; P5 -1.956,-3.912; P6 -1.295,-3.912; P7 -0.66,-3.912; P8 0,-3.912; P9 0.66,-3.912; P10 1.295,-3.912; P11 1.956,-3.912; P12 2.591,-3.912; P13 3.251,-3.912; P14 3.912,-3.912; P15 4.547,-3.912; R1 -4.547,-4.547; R2 -3.912,-4.547; R3 -3.251,-4.547; R4 -2.591,-4.547; R5 -1.956,-4.547; R6 -1.295,-4.547; R7 -0.66,-4.547; R8 0,-4.547; R9 0.66,-4.547; R10 1.295,-4.547; R11 1.956,-4.547; R12 2.591,-4.547; R13 3.251,-4.547; R14 3.912,-4.547; R15 4.547,-4.547
SOT23-5 = smd 0.55 x 1.2: 1 -0.95,-1.3; 2 0,-1.3; 3 0.95,-1.3; 4 0.95,1.3; 5 -0.95,1.3
USB-MICRO-SMD = smd 1.4 x 0.4: D+1 2.7,0; D-1 2.7,0.65; GND1 2.7,-1.3; ID1 2.7,-0.65; VBUS1 2.7,1.3 | hole 0.85: 2.2,1.9; 2.2,-1.9
ASE = smd 0.9 x 0.65: 1 -1.05,-0.825; 2 1.05,-0.825; 3 1.05,0.825; 4 -1.05,0.825
TSOP77338 = smd 0.8 x 1.8: 1 -1.905,0.635; 2 -0.633,0.635; 3 0.637,0.635; 4 1.905,0.635
SOT95P280X110-5N = smd 1.321 x 0.559: 1 -1.168,0.94; 2 -1.168,0; 3 -1.168,-0.94; 4 1.168,-0.94; 5 1.168,0.94
SWITCHSMD = smd 0.635 x 1.27: P$1 -2,1; P$2 1,1
QFN.24.4X4 = smd 0.85 x 0.38: 1 -1.975,1.25; 2 -1.975,0.75; 3 -1.975,0.25; 4 -1.975,-0.25; 5 -1.975,-0.75; 6 -1.975,-1.25; 13 1.975,-1.25; 14 1.975,-0.75; 15 1.975,-0.25; 16 1.975,0.25; 17 1.975,0.75; 18 1.975,1.25 | smd 0.38 x 0.85: 7 -1.25,-1.975; 8 -0.75,-1.975; 9 -0.25,-1.975; 10 0.25,-1.975; 11 0.75,-1.975; 12 1.25,-1.975; 19 1.25,1.975; 20 0.75,1.975; 21 0.25,1.975; 22 -0.25,1.975; 23 -0.75,1.975; 24 -1.25,1.975
LPCC16 = smd 0.8 x 0.3: 1 -1.5,0.75; 2 -1.5,0.25; 3 -1.5,-0.25; 4 -1.5,-0.75; 9 1.5,-0.75; 10 1.5,-0.25; 11 1.5,0.25; 12 1.5,0.75 | smd 0.3 x 0.8: 5 -0.75,-1.5; 6 -0.25,-1.5; 7 0.25,-1.5; 8 0.75,-1.5; 13 0.75,1.5; 14 0.25,1.5; 15 -0.25,1.5; 16 -0.75,1.5
CC2540-MINI-BLE = smd 2 x 0.8: 1 0,10.85; 2 0,9.55; 3 0,8.3; 4 0,7.05; 5 0,5.75; 6 0,4.5; 7 0,3.25; 8 0,1.95; 9 0,0.7; 10 11.9,0.7; 11 11.9,1.95; 12 11.9,3.25; 13 11.9,4.5; 14 11.9,5.75; 15 11.9,7.05; 16 11.9,8.3; 17 11.9,9.55; 18 11.9,10.85
QFN-16 = smd 0.3 x 0.85: 1 -0.75,-1.655; 2 -0.25,-1.655; 3 0.25,-1.655; 4 0.75,-1.655; 9 0.75,1.655; 10 0.25,1.655; 11 -0.25,1.655; 12 -0.75,1.655 | smd 0.85 x 0.3: 5 1.655,-0.75; 6 1.655,-0.25; 7 1.655,0.25; 8 1.655,0.75; 13 -1.655,0.75; 14 -1.655,0.25; 15 -1.655,-0.25; 16 -1.655,-0.75
ESP-03 = smd 1.5 x 1: ANT 7.4,4.8; CH_PD 7.4,2.8; GND 7.4,-7.2; GPIO0 -5.2,-7.2; GPIO2 -5.2,-5.2; GPIO12 -5.2,0.8; GPIO13 -5.2,-1.2; GPIO14 -5.2,2.8; GPIO15 -5.2,-3.2; GPIO18 7.4,0.8; NC 7.4,-5.2; URXD 7.4,-1.2; UTXD 7.4,-3.2; VCC -5.2,4.8
VISHAY_IRLED = smd 1.27 x 0.635: P$1 0,1.668; P$2 0,-1.638
MOJ_JACK = smd 2.55 x 1.1: CD1 -3.73,3.43; CD2 3.27,-5.853; KON -3.705,-5.903; MAS 3.27,3.43; SR 3.27,-0.07

### Placement (x,y rotation side)
C1  26.04,29.88 270 top
C2  19.78,39.73 90 bottom
C3  3.01,33.39 270 top
C4  43.66,17.27 90 top
C5  12.57,22.17 90 top
C6  6.46,39.8 270 top
C7  9.23,43.07 270 bottom
C8  14.1,33.84 180 top
C9  21.88,25.65 0 top
C11  9.08,38.47 90 bottom
C12  19.17,60.04 0 bottom
C13  17.82,35.14 0 bottom
C14  10.39,35.32 0 bottom
C16  15.37,38.58 180 bottom
C17  16.37,42.65 180 bottom
C18  12.56,43.58 270 bottom
C20  11.74,39.9 180 bottom
C21  19.81,34.26 0 top
C22  8.42,54.54 90 bottom
C23  10.25,60.77 0 bottom
C29  10.66,52.29 180 bottom
C35  10.4,27.23 90 bottom
C36  7.6,27.74 90 bottom
C38  3.95,27.37 90 bottom
C39  1.87,27.51 270 top
C40  8.59,29.46 0 bottom
C41  9.31,31.36 90 bottom
CN1  24.58,26.87 0 top
D3  30.75,33.44 0 top
IC3  7.34,29.14 0 top
IC7  6.68,36.11 0 top
IC8  29.39,39.96 180 top
L5  14.48,18.61 0 top
L!  20.45,33.2 180 top
LCD1  19.9,47.39 90 bottom
LED2  6.73,41.82 90 top
N-MOSFET  19.72,28.77 270 top
PAD11  -6.08,56.18 0 top  (outside the outline)
PAD12  -5.71,59.59 0 top  (outside the outline)
PAD15  8.91,90.68 0 top  (outside the outline)
PAD16  12.44,90.68 0 top  (outside the outline)
PAD17  15.97,90.68 0 top  (outside the outline)
PAD18  19.5,90.68 0 top  (outside the outline)
Q1  36.47,57.31 180 bottom
Q2  23.13,29.75 0 top
Q4  7.04,47.55 90 top
Q9  21.19,58.3 0 top
Q10  29.37,29.67 180 top
Q14  8.7,39.45 180 top
R1  34.61,41.56 270 top
R2  12.93,28.71 270 top
R3  22.51,60.15 90 top
R4  14.92,47.44 0 top
R5  27.43,20.17 90 bottom
R6  31.34,20.65 90 bottom
R7  23.25,20.12 270 top
R8  29.61,20.27 90 bottom
R9  33.52,21.39 90 bottom
R10  25.72,20.14 90 bottom
R11  35.71,20.09 90 bottom
R12  29.44,31.91 180 top
R13  14.91,25.09 0 top
R14  17.65,23.77 0 top
R16  16.67,29.75 180 top
R27  35.65,35.34 270 top
R28  4.01,41.79 0 top
R31  15.77,60.77 90 bottom
R32  13.88,60.76 90 bottom
R33  19.21,20.31 270 top
R34  17.62,20.33 270 top
R45  10.45,46.7 0 top
R49  7.55,25.58 270 bottom
R50  3.89,24.98 270 bottom
R51  10.36,24.87 270 bottom
R52  20.91,55.81 0 top
R54  21.29,20.7 0 top
R55  13.36,52.72 180 bottom
R64  18.97,25.98 270 top
R65  25.8,40.33 270 bottom
R66  18.88,31.1 0 top
R67  21.31,31.1 0 top
R72  32.4,51.14 180 bottom
R73  29.53,55.16 270 bottom
R74  31.77,57.36 180 bottom
R79  34.66,39.19 270 top
R85  16.59,34.09 0 top
TP3  10.01,35.95 0 top
TP4  10.04,34.87 0 top
TP9  -17.28,62.48 0 top  (outside the outline)
TP10  2.42,23.37 0 top
U1  16.03,40.04 90 top
U4  22.03,22.78 90 top
U5  19.27,14.38 90 top
U$1  11.45,29.72 180 bottom
U$2  35.78,40.39 270 top
U$4  15.18,22.4 270 top
U$5  37.58,31.45 90 top
U$11  12.3,56.71 0 bottom
U$12  20.72,56.24 90 bottom
U$13  23.39,62.64 270 top
U$15  33.23,54.17 0 bottom
U$16  2.11,36.66 270 top
U$23  10.09,55.72 90 top
U$26  21.09,62.59 270 top
U$30  2.23,46.79 270 top
U$31  15.84,32 0 top
U$32  6.97,16.3 180 bottom

### Tracks (layer width: path | path; a pad name or v marks a point on that pad's centre or on a via)
+3V3  (via drill 0.15, 0.25)  (17 unrouted)
  Top 0.152: U1.G13 U1.H13 U1.J13 U1.J12 16.69,42.26 17.01,41.94 18.05,41.94 18.33,41.66 18.96,41.66 U1.N10 U1.N9 U1.N8 | U1.C9 U1.C8 U1.C7 U1.C6 U1.C5 v13.1,37.77 14.22,37.77 14.42,37.57 | v12.77,34.87 U1.C1 | U1.G3 U1.F3 14.69,36.79 14.42,37.06 14.42,37.57 | U1.K4 17.33,37.51 17.01,37.82 14.68,37.82 14.42,37.57 | U1.P1 19.94,35.27 19.8,35.13 L!.2
  Top 0.229: U$4.4 v15.06,21.23 | v23.21,18.69 23.21,19.42 R7.2 | Q9.2 29.17,57.3 32.96,61.09 32.96,61.98 33.04,62.05 33.04,62.53 U$13.2
  Top 0.254: v6.39,48.77 7.77,48.77 Q4.2 | C6.1 Q14.2 7.75,40.5 v8.4,41.15
  Top 0.381: L5.1 12.57,19.33 C5.1 14.18,21.17 U$4.4
  Route2 0.152: v12.77,34.87 13.1,35.2 v13.1,37.77 13.73,38.41 v14.04,38.41
  Route2 0.229: v15.06,21.23 20.67,21.23 v23.21,18.69 | v24.07,56.74 24.07,54.18 23.31,53.42 v20.87,53.42 | v12.69,60.91 12.69,56.46 v12.31,56.08
  Route2 0.254: v6.39,51.89 v6.39,48.77 8.4,46.76 v8.4,43.79 v8.4,41.15
  Bottom 0.152: C16.1 14.44,38.81 v14.04,38.41 | U$15.6 33.14,53.92 33.65,54.43 U$15.14 | U$15.14 | U$15.14 35.43,54.43 35.66,54.66 35.66,56.95 36.09,57.38 37.23,57.38 37.51,57.66 37.51,58.22 Q1.2
  Bottom 0.229: U$12.13 23.83,56.99 v24.07,56.74 26.89,53.92 U$15.6 | U$12.4 19.96,54.72 19.96,53.8 20.34,53.42 v20.87,53.42 20.98,53.52 U$12.2 | R31.2 R32.2 13.2,61.41 v12.69,60.91
  Bottom 0.254: C22.2 7.63,55.42 6.39,54.18 v6.39,51.89 | C7.1 8.45,43.74 v8.4,43.79
  Bottom 0.305: U$11.13 10.81,55.46 11.34,55.99 11.43,56.08 v12.31,56.08 13.05,55.35 U$11.8
  Bottom 0.381: U$11.13 8.46,55.46 C22.2
+4.1V  (1 unrouted)
  Top 0.381: U$4.1 16.79,23.57 R14.1 | U4.3 22.88,24.18 C9.2 24.08,26.85 Q2.2 25.92,28.75 C1.2 27.38,28.88 28.25,29.75 34.23,29.75 34.47,29.5 36.53,29.5 U$5.P$1
A0  (1 unrouted)
A1  (1 unrouted)
A2  (1 unrouted)
A3  (1 unrouted)
A4  (1 unrouted)
A5  (1 unrouted)
A6  (1 unrouted)
A7  (1 unrouted)
A8  (1 unrouted)
A9  (1 unrouted)
A10  (1 unrouted)
A11  (1 unrouted)
A12  (1 unrouted)
A13  (1 unrouted)
A14  (1 unrouted)
A15  (1 unrouted)
A16  (2 unrouted)
A17  (1 unrouted)
A18  (1 unrouted)
BAT_ADC  (1 unrouted)
  Top 0.229: R66.2 R67.1 | R67.1
BCTS  (1 unrouted)
BLE_EN  (1 unrouted)
BLE_RX  (1 unrouted)
BLE_TX  (1 unrouted)
BRTS  (1 unrouted)
CARD_DETECT  (1 unrouted)
CPU_ON  (1 unrouted)
CSB  (1 unrouted)
D0  (2 unrouted)
D1  (2 unrouted)
D2  (2 unrouted)
D3  (2 unrouted)
D4  (2 unrouted)
D5  (2 unrouted)
D6  (2 unrouted)
D7  (2 unrouted)
D8  (2 unrouted)
D9  (2 unrouted)
D10  (2 unrouted)
D11  (2 unrouted)
D12  (2 unrouted)
D13  (2 unrouted)
D14  (2 unrouted)
D15  (2 unrouted)
DIVIDE_ON  (1 unrouted)
DM  (1 unrouted)
DP  (1 unrouted)
DRDY-  (1 unrouted)
GND  (via drill 0.15)  (5 unrouted)
  Top 0.127: C6.2 6.53,39.15 6.55,39.17
  Top 0.152: C21.1 18.61,34.8 18.61,35.49 U1.M1 | C21.1 v18.54,34.26 v18.54,34.27 C21.1 | C8.2 13.45,34.18 14.42,35.15 14.42,35.82 U1.F2 U1.G2 15.07,36.13 v15.06,36.14 | U$31.4 15.24,32.83 U$31.2 18.16,31.18 R66.1
  Top 0.229: R66.1 18.23,30.89 18.1,30.76 18.1,30.89 18.18,30.96
  Top 0.381: U5.GND1 20.57,18.53 21.91,19.87 21.91,20.68 R54.2 21.94,22.09 22.65,22.8 23.31,22.8 U4.2 22.3,22.78 21.91,23.16 21.91,24.14 21.18,24.87 21.18,25.36 C9.1 | C5.2 12.64,23.17 13.38,22.43 14.96,22.43 15.21,22.68 15.21,23.55 U$4.2
  Route2 0.152: v15.06,36.14 15.06,35 15.82,34.24 18.51,34.24 v18.54,34.27
  pour Bottom: 0.48,12.19 0.48,64.52 39.59,64.52 39.59,11.68 0.48,11.68
  pour Top: 0.48,11.68 39.59,11.68 39.59,64.26 0.48,64.26
INT_ACC  (1 unrouted)
IR_LED  (1 unrouted)
LB  (1 unrouted)
LCD_ON  (1 unrouted)
MP3-CS  (1 unrouted)
MP3-DCS  (1 unrouted)
MP3-DREQ  (1 unrouted)
MP3-MISO  (1 unrouted)
MP3-MOSI  (1 unrouted)
MP3-RST  (1 unrouted)
MP3-SCK  (1 unrouted)
MP3_ON  (1 unrouted)
N$1
  Bottom 0.254: Q1.3 36.47,50.67 35.88,50.09 35.88,47.41 | 35.88,47.41 LCD1.3 | 35.88,47.41 36.88,47.41 LCD1.2
N$3  (1 unrouted)
N$4
  Top 0.229: U$2.3 34.75,39.75 R79.1
N$5
  Top 0.229: U$26.P$1 22.76,61.05 R3.2
N$6
  Top 0.152: U1.R1 20.58,34.38 C21.2 20.45,33.84 L!.1
N$7
  Top 0.229: Q2.1 22.16,28.77 N-MOSFET.3 20.82,27.63 19.8,26.62 19.8,26.06 19.7,25.96 17.9,25.96 17.77,25.83 17.77,24.3 R14.2
N$8  (1 unrouted)
N$9  (1 unrouted)
N$10
  Top 0.229: U$4.3 14.24,25.06 R13.1 14.34,25.17 14.34,25.91 14.62,26.19 16.05,26.19 16.83,26.98 16.83,28.12 17.44,28.73 19.42,28.73 19.68,28.98 19.68,29.31 20.11,29.74 23.77,29.74 24.2,30.18 24.2,31.42 26.22,33.44 D3.C
N$11
  Top 0.229: R16.1 18.59,29.75 N-MOSFET.1
N$12
  Top 0.381: U$4.5 16.12,19.05 L5.2
N$13
  Top 0.229: R67.2 22.78,31.11 Q2.3
N$30  (1 unrouted)
N$39  (1 unrouted)
N$41  (1 unrouted)
N$43  (1 unrouted)
N$44  (1 unrouted)
N$48
  Bottom 0.229: C23.1 11.26,60.16 11.55,59.87 U$11.20
N$51
  Bottom 0.229: U$11.9 12.55,52.89 R55.1
N$52
  Top 0.381: U4.5 20.73,20.79 R54.1
N$53
  Top 0.229: R33.2 19.21,17.14 U5.D+1
N$54
  Top 0.229: U5.D-1 18.62,18.67 R34.2
N$55  (1 unrouted)
N$56
  Bottom 0.229: C12.2 18.17,57.34 18.54,56.97 19.21,56.97 U$12.8
N$60
  Bottom 0.229: C22.1 8.42,51.52 8.98,50.95 15.23,50.95 17.57,53.29 17.57,58.06 16.78,58.85 16.78,60.71 17.57,61.49 18.76,61.49 19.2,61.06 19.2,58.9 19.42,58.67 20.14,58.67 20.47,58.34 U$12.10
N$61
  Bottom 0.229: U$11.10 12.05,52.8 C29.2
N$70
  Bottom 0.152: 31.54,54.46 U$15.7
  Bottom 0.229: 31.54,54.46 29.58,54.46 R73.2
N$71
  Bottom 0.152: R74.2 32.42,55.89 U$15.9
N$72
  Bottom 0.254: U$15.3 32.98,51.21 R72.2
N$73
  Top 0.381: R12.1 30.09,31.57 30.33,31.33 Q10.1
N$75  (2 unrouted)
N$76  (2 unrouted)
N$77  (2 unrouted)
N$84  (1 unrouted)
N$85  (7 unrouted)
N$86  (1 unrouted)
N$87
  Top 0.229: R3.1 21.39,59.5 Q9.3
N$90  (3 unrouted)
N$91  (1 unrouted)
N$94  (1 unrouted)
N$100  (1 unrouted)
N$101  (1 unrouted)
N$102  (1 unrouted)
N$103  (1 unrouted)
N$104  (1 unrouted)
N$105  (1 unrouted)
N$115
  Top 0.229: U$2.2 34.72,41.02 R1.2
N$118  (1 unrouted)
N$119  (1 unrouted)
NE3  (1 unrouted)
OSC1  (1 unrouted)
  Top 0.152: U1.H1 16.03,35.3 R85.2 17.24,33.19 U$31.3
OSC2
  Top 0.152: U1.G1 15.37,34.66 R85.1 14.99,34.09 C8.1 14.51,33.84 14.04,33.38 14.04,31.93 U$31.1
OSC_MP3_1  (3 unrouted)
OSC_MP3_2  (3 unrouted)
RDB  (2 unrouted)
RST  (1 unrouted)
SCL  (3 unrouted)
  Bottom 0.229: R32.1 13.45,60.11 13.05,59.72 U$11.23
SD_ON  (1 unrouted)
SDA  (3 unrouted)
  Bottom 0.229: U$11.24 15.4,58.69 15.84,59.13 15.84,60.05 R31.1
SDIO_CLK  (via drill 0.15)  (1 unrouted)
  Top 0.229: CN1.5 29.18,18.27 v29.56,18.64
  Bottom 0.229: v29.56,18.64 29.56,19.57 R8.1
SDIO_CMD  (via drill 0.15)  (1 unrouted)
  Top 0.229: CN1.3 31.38,18.05 v31.62,18.29
  Bottom 0.229: v31.62,18.29 31.62,19.72 R6.1
SDIO_D0  (via drill 0.15)  (1 unrouted)
  Top 0.229: CN1.7 26.98,17.69 v27.35,18.06
  Bottom 0.229: v27.35,18.06 27.35,19.44 R5.1
SDIO_D1  (via drill 0.15)  (1 unrouted)
  Top 0.229: CN1.8 25.88,17.98 v25.72,18.14
  Bottom 0.229: v25.72,18.14 R10.1
SDIO_D2  (via drill 0.15)  (1 unrouted)
  Top 0.229: CN1.1 33.83,16.23 v35.6,18.01
  Bottom 0.229: v35.6,18.01 35.6,19.34 R11.1
SDIO_D3  (via drill 0.15)  (1 unrouted)
  Top 0.229: CN1.2 32.48,18.24 v33.55,19.3
  Bottom 0.229: v33.55,19.3 33.55,20.71 R9.1
STAT  (1 unrouted)
  Top 0.381: U4.1 23.33,20.84 R7.1
SUPPLY  (7 unrouted)
SW1  (1 unrouted)
SW2  (1 unrouted)
  Top 0.229: U$5.P$2 33.64,32.45 D3.A
SW3  (1 unrouted)
SWCLK  (1 unrouted)
SWDIO  (1 unrouted)
TOUCH_INT  (1 unrouted)
TSOP  (1 unrouted)
UB  (1 unrouted)
USB_ADC  (2 unrouted)
V+  (4 unrouted)
VBUS
  Top 0.229: U5.VBUS1 17.97,17.79 16.73,19.02 16.73,20.14 16.94,20.34 18.26,20.34 18.46,20.55 18.46,22.48 19.86,23.88
  Top 0.381: U4.4 20,23.73 19.86,23.88 19.23,24.51 19.23,25.27 R64.2
VDD  (via drill 0.15)  (1 unrouted)
  Top 0.229: CN1.4 30.28,18.02 30.58,18.31 30.58,20.98 v30.47,21.08
  Bottom 0.229: R10.2 25.75,20.82 R5.2 27.53,20.92 R8.2 29.77,21.08 v30.47,21.08 31.12,21.08 R6.2 32.14,21.3 33.01,22.17 33.38,22.17 R9.2 34.41,22.04 R11.2
WIFI_ON  (1 unrouted)
WIFI_RX  (1 unrouted)
WIFI_TX  (1 unrouted)
WRB  (2 unrouted)
(copper drawn outside any net)
  shapes: Bottom area x2